# Altium project fillcap.PrjPcb
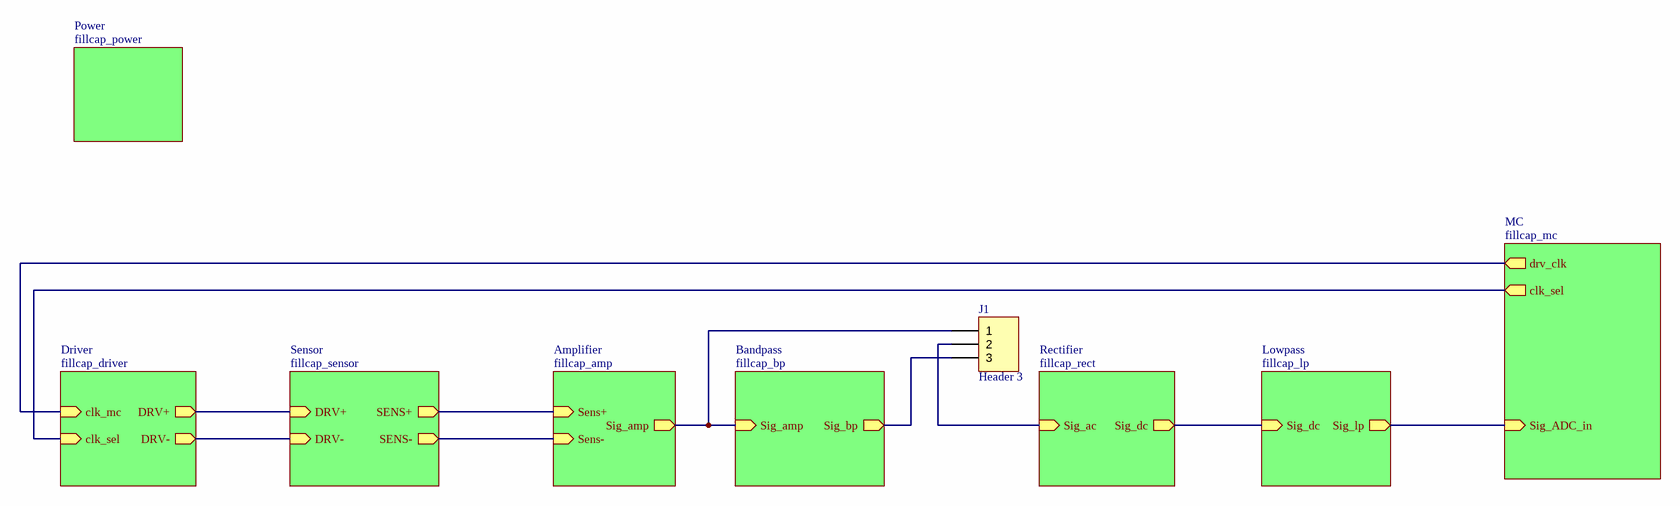
[diagram p0: fillcap_top.SchDoc]
9 sheets, 65 parts. Net scope: hierarchical (ports join the sheet entries above them; power ports are global).
Board file: fillcap.PcbDoc
Sheets:
  fillcap_top.SchDoc
    Driver = fillcap_driver.SchDoc
    Sensor = fillcap_sensor.SchDoc
    Amplifier = fillcap_amp.SchDoc
    Bandpass = fillcap_bp.SchDoc
    Rectifier = fillcap_rect.SchDoc
    Lowpass = fillcap_lp.SchDoc
    MC = fillcap_mc.SchDoc
    Power = fillcap_power.SchDoc

## Sheet fillcap_top.SchDoc: Top
size A3; DrawnBy: daniw / ninux; Organization: HSLU T&A; Address1: Abteilung Elektrotechnik; Address2: Technikumsstrasse 21; Address3: CH-6048 Horw; SheetNumber: 1; SheetTotal: 9; Projektname: fillcap

### Parts
J1  Header 3  [HDR1X3]

### Sub-sheets
Amplifier = fillcap_amp: Sens+ (in), Sens- (in), Sig_amp (out)
Bandpass = fillcap_bp: Sig_amp (in), Sig_bp (out)
Driver = fillcap_driver: DRV+ (out), DRV- (out), clk_mc (in), clk_sel (in)
Lowpass = fillcap_lp: Sig_dc (in), Sig_lp (out)
MC = fillcap_mc: Sig_ADC_in (in), drv_clk (out), clk_sel (out)
Power = fillcap_power: no entries
Rectifier = fillcap_rect: Sig_ac (in), Sig_dc (out)
Sensor = fillcap_sensor: DRV+ (in), DRV- (in), SENS+ (out), SENS- (out)

### Nets
NetC102#1_2: sheet Driver/DRV+, sheet Sensor/DRV+
NetC103#1_2: sheet Driver/DRV-, sheet Sensor/DRV-
NetC401_2: J1.1 ; sheet Amplifier/Sig_amp, sheet Bandpass/Sig_amp
NetC402_1: J1.3 ; sheet Bandpass/Sig_bp
NetC501_2: J1.2 ; sheet Rectifier/Sig_ac
NetC502_1: sheet Rectifier/Sig_dc, sheet Lowpass/Sig_dc
NetJ201_4: sheet Sensor/SENS+, sheet Amplifier/Sens+
NetJ202_4: sheet Sensor/SENS-, sheet Amplifier/Sens-
NetR604_2: sheet Lowpass/Sig_lp, sheet MC/Sig_ADC_in
NetU101_5: sheet Driver/clk_sel, sheet MC/clk_sel
NetU101_13: sheet Driver/clk_mc, sheet MC/drv_clk

### Notes on the sheet
- Project:
- Drawn by:
- Size:
- Sheet
- A3
- Rev.:
- of
- Date:
- File:

### Library data of the parts
J1 = Header 3: Header, 3-Pin; LatestRevisionDate: 17-Jul-2002; LatestRevisionNote: Re-released for DXP Platform.; Publisher: Altium Limited

## Sheet fillcap_driver.SchDoc: Driver
size A3; DrawnBy: daniw / ninux; Organization: HSLU T&A; Address1: Abteilung Elektrotechnik; Address2: Technikumsstrasse 21; Address3: CH-6048 Horw; SheetNumber: 2; SheetTotal: 9; Projektname: fillcap
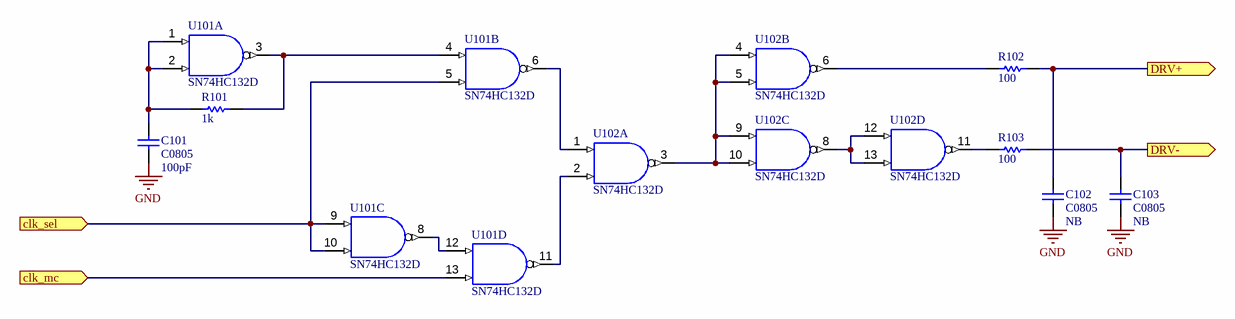
[diagram p1: fillcap_driver.SchDoc]

### Parts
(Parts that share a designator on the sheet are numbered #1, #2 ... from top to bottom, then left to right.)
C101  C0805  value 100pF  [0805]
C102#1  C0805  value NB  [0805]
C103#1  C0805  value NB  [0805]
R101  1k  [ERA-0805]
R102  100  [ERA-0805]
R103  100  [ERA-0805]
U101  SN74HC132D  [D014_N]  (parts A,B,C,D of 4)
U102  SN74HC132D  [D014_N]  (parts A,B,C,D of 4)

### Ports
clk_mc (in), clk_sel (in), DRV+ (out), DRV- (out)

### Nets
GND: C101.1 C102#1.1 C103#1.1 U101.7(GND) U102.7(GND)
VCC: U101.14(VCC) U102.14(VCC)
NetC101_2: C101.2 R101.1 U101.1(A) U101.2(B)
NetC102#1_2: C102#1.2 R102.2 ; port DRV+
NetC103#1_2: C103#1.2 R103.2 ; port DRV-
NetR101_2: R101.2 U101.3(Y) U101.4(A)
NetR102_1: R102.1 U102.6(Y)
NetR103_1: R103.1 U102.11(Y)
NetU101_5: U101.5(B) U101.9(A) U101.10(B) ; port clk_sel
NetU101_6: U101.6(Y) U102.1(A)
NetU101_8: U101.8(Y) U101.12(A)
NetU101_11: U101.11(Y) U102.2(B)
NetU101_13: U101.13(B) ; port clk_mc
NetU102_3: U102.3(Y) U102.4(A) U102.5(B) U102.9(A) U102.10(B)
NetU102_8: U102.8(Y) U102.12(A) U102.13(B)

### Notes on the sheet
- Project:
- Drawn by:
- Size:
- Sheet
- A3
- Rev.:
- of
- Date:
- File:

### Library data of the parts
C101 C102#1 C103#1 = C0805: Ceramic Chip Capacitor - Standard; Note: Footprint corresponds to dimensions for bulk cassette packaging. This case size has tightened tolerances.; Published: 17-Jul-2002; LatestRevisionDate: 19-Mar-2004; LatestRevisionNote: Silkscreen size reduced.; DatasheetDocument: Mar-2001; PackageDocument: Mar-2001; PackageReference: 0805; Publisher: Altium Limited; Code_JEITA: 0805; Code_IPC: 2012[0805]; ComponentLink1Description: Manufacturer Link; ComponentLink1URL: http://www.kemet.com/; ComponentLink2Description: Datasheet; ComponentLink2URL: http://www.kemet.com/kemet/web/homepage/kechome.nsf/vapubfilesname/F3102TA.pdf/$file/F3102TA.pdf
R101-R103 = ERAS: Metal Film Thermosensitive Chip Resistor, 0.56 Ohm to 10k Ohm Range, 5% Tolerance, 0805 Size, 0.1 W; Note: If flow soldering, adjust pad width of PCB Footprint to 0.7 - 0.8 times the width of the resistor.; Published: 17-Dec-2003; LatestRevisionDate: 19-Mar-2004; LatestRevisionNote: Silkscreen size reduced.; PackageDocument: Mar-2003; PackageReference: ERA-0805; Publisher: Altium Limited; Code_IPC: 2012 [0805]; ComponentLink1Description: Manufacturer Link; ComponentLink1URL: http://www.panasonic.com/industrial/components/resistive_products.htm; ComponentLink2Description: Datasheet; ComponentLink2URL: http://www.panasonic.com/industrial/components/pdf/AOF0000CE1.pdf
U101 U102 = SN74HC132D: Quadruple Positive-NAND Gate with Schmitt-Trigger Inputs; Published: 8-Jun-2000; LatestRevisionDate: 13-Apr-2006; LatestRevisionNote: IPC-7351 Footprint Added.; DatasheetVersion: May-1997; PackageVersion: Jan-1998; PackageReference: D014; Publisher: Altium Limited; PackageDescription: 14-Pin Small Outline Integrated Circuit 1.27 mm Pitch; Code_IPC: SOIC127P600-14; ComponentLink1Description: Manufacturer Link; ComponentLink1URL: http://www.ti.com/; ComponentLink2Description: Datasheet; ComponentLink2URL: http://www-s.ti.com/sc/ds/sn74hc132.pdf

## Sheet fillcap_sensor.SchDoc: Sensor
size A3; DrawnBy: daniw / ninux; Organization: HSLU T&A; Address1: Abteilung Elektrotechnik; Address2: Technikumsstrasse 21; Address3: CH-6048 Horw; SheetNumber: 3; SheetTotal: 9; Projektname: fillcap
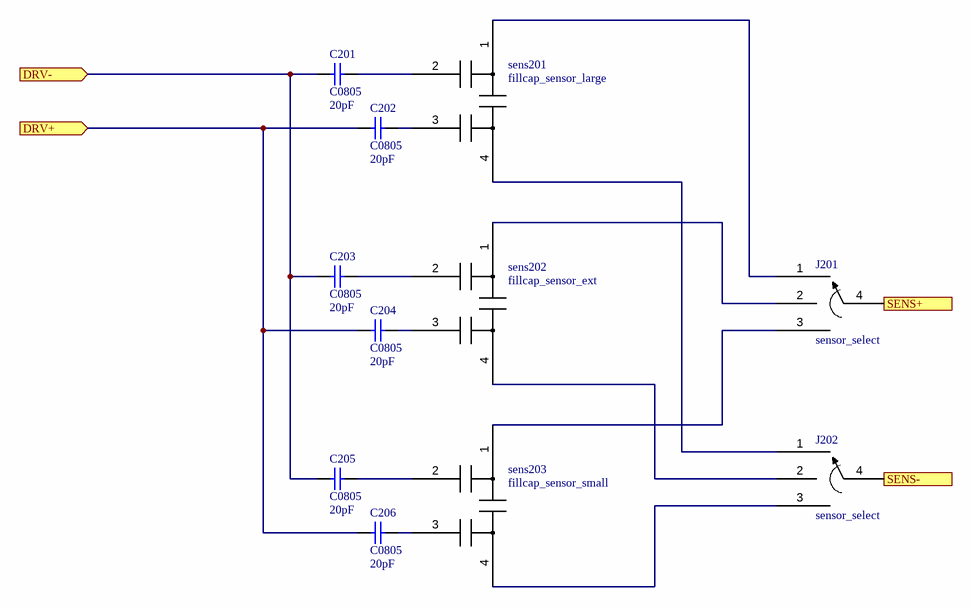
[diagram p2: fillcap_sensor.SchDoc]

### Parts
C201  C0805  value 20pF  [0805]
C202  C0805  value 20pF  [0805]
C203  C0805  value 20pF  [0805]
C204  C0805  value 20pF  [0805]
C205  C0805  value 20pF  [0805]
C206  C0805  value 20pF  [0805]
J201  sensor_select  [sens_select_jumper]
J202  sensor_select  [sens_select_jumper]
sens201  fillcap_sensor_large  [fillcap_sensor_large]
sens202  fillcap_sensor_ext  [fillcap_sensor_ext]
sens203  fillcap_sensor_small  [fillcap_sensor_small]

### Ports
DRV+ (in), DRV- (in), SENS+ (out), SENS- (out)

### Nets
NetC102#1_2: C202.2 C204.2 C206.2 ; port DRV+
NetC103#1_2: C201.2 C203.2 C205.2 ; port DRV-
NetC201_1: C201.1 sens201.2
NetC202_1: C202.1 sens201.3
NetC203_1: C203.1 sens202.2
NetC204_1: C204.1 sens202.3
NetC205_1: C205.1 sens203.2
NetC206_1: C206.1 sens203.3
NetJ201_1: J201.1 sens201.1
NetJ201_2: J201.2 sens202.1
NetJ201_3: J201.3 sens203.1
NetJ201_4: J201.4 ; port SENS+
NetJ202_1: J202.1 sens201.4
NetJ202_2: J202.2 sens202.4
NetJ202_3: J202.3 sens203.4
NetJ202_4: J202.4 ; port SENS-

### Notes on the sheet
- Project:
- Drawn by:
- Size:
- Sheet
- A3
- Rev.:
- of
- Date:
- File:

### Library data of the parts
C201-C206 = C0805: as C101 on sheet fillcap_driver; Published: 17-Jul-2002; LatestRevisionDate: 19-Mar-2004; LatestRevisionNote: Silkscreen size reduced.; DatasheetDocument: Mar-2001; PackageDocument: Mar-2001; PackageReference: 0805; Publisher: Altium Limited; Code_JEITA: 0805; Code_IPC: 2012[0805]; ComponentLink1Description: Manufacturer Link; ComponentLink1URL: http://www.kemet.com/; ComponentLink2Description: Datasheet; ComponentLink2URL: http://www.kemet.com/kemet/web/homepage/kechome.nsf/vapubfilesname/F3102TA.pdf/$file/F3102TA.pdf
sens201-sens203 = fillcap_sensor

## Sheet fillcap_amp.SchDoc: Amplifier
size A3; DrawnBy: daniw / ninux; Organization: HSLU T&A; Address1: Abteilung Elektrotechnik; Address2: Technikumsstrasse 21; Address3: CH-6048 Horw; SheetNumber: 4; SheetTotal: 9; Projektname: fillcap
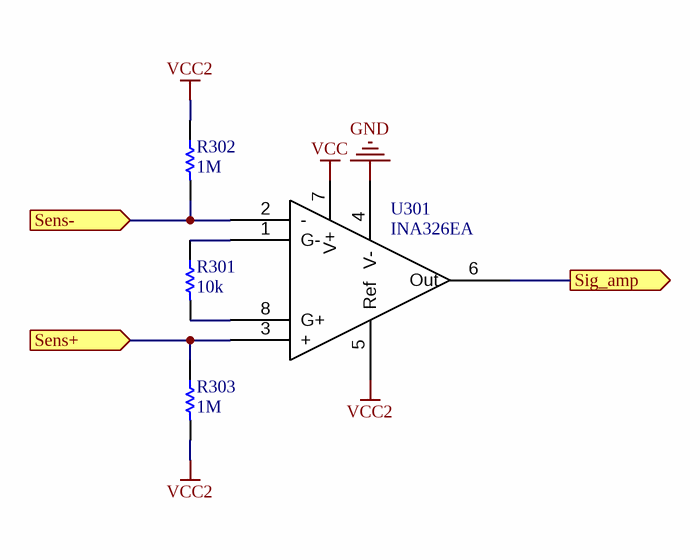
[diagram p3: fillcap_amp.SchDoc]

### Parts
R301  10k  [ERA-0805]
R302  1M  [ERA-0805]
R303  1M  [ERA-0805]
U301  INA326EA  [VSSOP8(0.65mm)]

### Ports
Sens+ (in), Sens- (in), Sig_amp (out)

### Nets
GND: U301.4(V-)
VCC: U301.7(V+)
VCC2: R302.1 R303.2 U301.5(Ref)
NetC401_2: U301.6(Out) ; port Sig_amp
NetJ201_4: R303.1 U301.3(+) ; port Sens+
NetJ202_4: R302.2 U301.2(-) ; port Sens-
NetR301_1: R301.1 U301.1(G-)
NetR301_2: R301.2 U301.8(G+)

### Notes on the sheet
- Project:
- Drawn by:
- Size:
- Sheet
- A3
- Rev.:
- of
- Date:
- File:

### Library data of the parts
R301-R303 = ERAS: as R101 on sheet fillcap_driver; Published: 17-Dec-2003; LatestRevisionDate: 19-Mar-2004; LatestRevisionNote: Silkscreen size reduced.; PackageDocument: Mar-2003; PackageReference: ERA-0805; Publisher: Altium Limited; Code_IPC: 2012 [0805]; ComponentLink1Description: Manufacturer Link; ComponentLink1URL: http://www.panasonic.com/industrial/components/resistive_products.htm; ComponentLink2Description: Datasheet; ComponentLink2URL: http://www.panasonic.com/industrial/components/pdf/AOF0000CE1.pdf

## Sheet fillcap_bp.SchDoc: Bandpass
size A3; DrawnBy: daniw / ninux; Organization: HSLU T&A; Address1: Abteilung Elektrotechnik; Address2: Technikumsstrasse 21; Address3: CH-6048 Horw; SheetNumber: 5; SheetTotal: 9; Projektname: fillcap
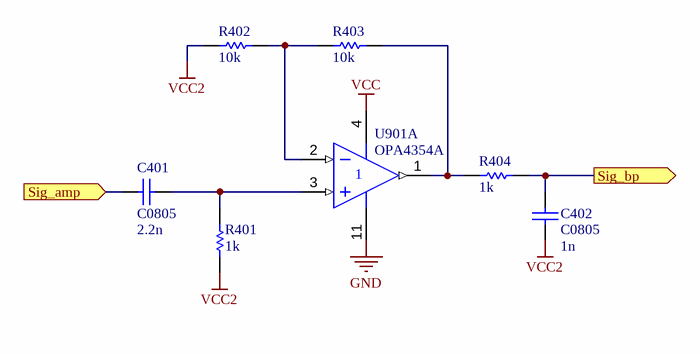
[diagram p4: fillcap_bp.SchDoc]

### Parts
C401  C0805  value 2.2n  [0805]
C402  C0805  value 1n  [0805]
R401  1k  [ERA-0805]
R402  10k  [ERA-0805]
R403  10k  [ERA-0805]
R404  1k  [ERA-0805]
U901  OPA4354A  [D014_N]  (part A of 4)

### Ports
Sig_amp (in), Sig_bp (out)

### Nets
GND: U901.11(V-)
VCC: U901.4(V+)
VCC2: C402.2 R401.2 R402.1
NetC401_1: C401.1 R401.1 U901.3(IN+)
NetC401_2: C401.2 ; port Sig_amp
NetC402_1: C402.1 R404.2 ; port Sig_bp
NetR402_2: R402.2 R403.1 U901.2(IN-)
NetR403_2: R403.2 R404.1 U901.1(OUT)

### Notes on the sheet
- Project:
- Drawn by:
- Size:
- Sheet
- A3
- Rev.:
- of
- Date:
- File:

### Library data of the parts
C401 C402 = C0805: as C101 on sheet fillcap_driver; Published: 17-Jul-2002; LatestRevisionDate: 19-Mar-2004; LatestRevisionNote: Silkscreen size reduced.; DatasheetDocument: Mar-2001; PackageDocument: Mar-2001; PackageReference: 0805; Publisher: Altium Limited; Code_JEITA: 0805; Code_IPC: 2012[0805]; ComponentLink1Description: Manufacturer Link; ComponentLink1URL: http://www.kemet.com/; ComponentLink2Description: Datasheet; ComponentLink2URL: http://www.kemet.com/kemet/web/homepage/kechome.nsf/vapubfilesname/F3102TA.pdf/$file/F3102TA.pdf
R401-R404 = ERAS: as R101 on sheet fillcap_driver; Published: 17-Dec-2003; LatestRevisionDate: 19-Mar-2004; LatestRevisionNote: Silkscreen size reduced.; PackageDocument: Mar-2003; PackageReference: ERA-0805; Publisher: Altium Limited; Code_IPC: 2012 [0805]; ComponentLink1Description: Manufacturer Link; ComponentLink1URL: http://www.panasonic.com/industrial/components/resistive_products.htm; ComponentLink2Description: Datasheet; ComponentLink2URL: http://www.panasonic.com/industrial/components/pdf/AOF0000CE1.pdf
U901 = LM324AD: Quadruple Operational Amplifier; Published: 15-Apr-2002; LatestRevisionDate: 13-Apr-2006; LatestRevisionNote: IPC-7351 Footprint Added.; DatasheetVersion: Jan-1989; PackageVersion: Jan-1998; PackageReference: D014; Publisher: Altium Limited; PackageDescription: 14-Pin Small Outline Integrated Circuit 1.27 mm Pitch; Code_IPC: SOIC127P600-14; ComponentLink1Description: Manufacturer Link; ComponentLink1URL: http://www.ti.com/; ComponentLink2Description: Datasheet; ComponentLink2URL: http://www-s.ti.com/sc/ds/lm324.pdf

## Sheet fillcap_rect.SchDoc: Rectifier
size A3; DrawnBy: daniw / ninux; Organization: HSLU T&A; Address1: Abteilung Elektrotechnik; Address2: Technikumsstrasse 21; Address3: CH-6048 Horw; SheetNumber: 6; SheetTotal: 9; Projektname: fillcap
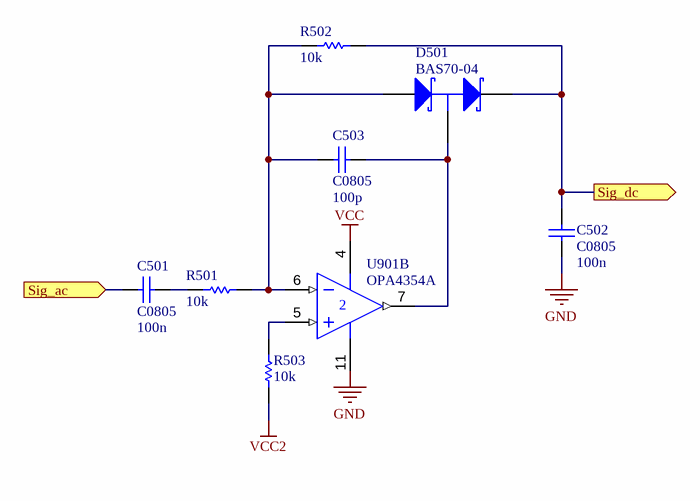
[diagram p5: fillcap_rect.SchDoc]

### Parts
C501  C0805  value 100n  [0805]
C502  C0805  value 100n  [0805]
C503  C0805  value 100p  [0805]
D501  BAS70-04  [SOT23_N]
R501  10k  [ERA-0805]
R502  10k  [ERA-0805]
R503  10k  [ERA-0805]
U901  OPA4354A  [D014_N]  (part B of 4)

### Ports
Sig_ac (in), Sig_dc (out)

### Nets
GND: C502.2 U901.11(V-)
VCC: U901.4(V+)
VCC2: R503.1
NetC501_1: C501.1 R501.1
NetC501_2: C501.2 ; port Sig_ac
NetC502_1: C502.1 D501.2(K) R502.2 ; port Sig_dc
NetC503_1: C503.1 D501.3(C) U901.7(OUT)
NetC503_2: C503.2 D501.1(A) R501.2 R502.1 U901.6(IN-)
NetR503_2: R503.2 U901.5(IN+)

### Notes on the sheet
- Project:
- Drawn by:
- Size:
- Sheet
- A3
- Rev.:
- of
- Date:
- File:

### Library data of the parts
C501-C503 = C0805: as C101 on sheet fillcap_driver; Published: 17-Jul-2002; LatestRevisionDate: 19-Mar-2004; LatestRevisionNote: Silkscreen size reduced.; DatasheetDocument: Mar-2001; PackageDocument: Mar-2001; PackageReference: 0805; Publisher: Altium Limited; Code_JEITA: 0805; Code_IPC: 2012[0805]; ComponentLink1Description: Manufacturer Link; ComponentLink1URL: http://www.kemet.com/; ComponentLink2Description: Datasheet; ComponentLink2URL: http://www.kemet.com/kemet/web/homepage/kechome.nsf/vapubfilesname/F3102TA.pdf/$file/F3102TA.pdf
D501 = BAS70-04: Schottky Barrier Double Diode; Published: 17-Sep-2003; LatestRevisionDate: 12-Dec-2006; LatestRevisionNote: IPC-7351 Footprint Added.; DatasheetVersion: 11-Oct-2001; PackageVersion: May-1999; PackageReference: SOT23; Publisher: Altium Limited; PackageDescription: 3-Pin SOT-23 Package 0.95 mm Pitch, 2.3 mm Lead Span; ComponentLink1Description: Manufacturer Link; ComponentLink1URL: http://www.semiconductors.philips.com/; ComponentLink2Description: Datasheet; ComponentLink2URL: http://www.semiconductors.philips.com/acrobat/datasheets/BAS70_SERIES_6.pdf
R501-R503 = ERAS: as R101 on sheet fillcap_driver; Published: 17-Dec-2003; LatestRevisionDate: 19-Mar-2004; LatestRevisionNote: Silkscreen size reduced.; PackageDocument: Mar-2003; PackageReference: ERA-0805; Publisher: Altium Limited; Code_IPC: 2012 [0805]; ComponentLink1Description: Manufacturer Link; ComponentLink1URL: http://www.panasonic.com/industrial/components/resistive_products.htm; ComponentLink2Description: Datasheet; ComponentLink2URL: http://www.panasonic.com/industrial/components/pdf/AOF0000CE1.pdf
U901 = LM324AD: Quadruple Operational Amplifier; Published: 15-Apr-2002; LatestRevisionDate: 13-Apr-2006; LatestRevisionNote: IPC-7351 Footprint Added.; DatasheetVersion: Jan-1989; PackageVersion: Jan-1998; PackageReference: D014; Publisher: Altium Limited; PackageDescription: 14-Pin Small Outline Integrated Circuit 1.27 mm Pitch; Code_IPC: SOIC127P600-14; ComponentLink1Description: Manufacturer Link; ComponentLink1URL: http://www.ti.com/; ComponentLink2Description: Datasheet; ComponentLink2URL: http://www-s.ti.com/sc/ds/lm324.pdf

## Sheet fillcap_lp.SchDoc: Lowpass
size A3; DrawnBy: daniw / ninux; Organization: HSLU T&A; Address1: Abteilung Elektrotechnik; Address2: Technikumsstrasse 21; Address3: CH-6048 Horw; SheetNumber: 7; SheetTotal: 9; Projektname: fillcap
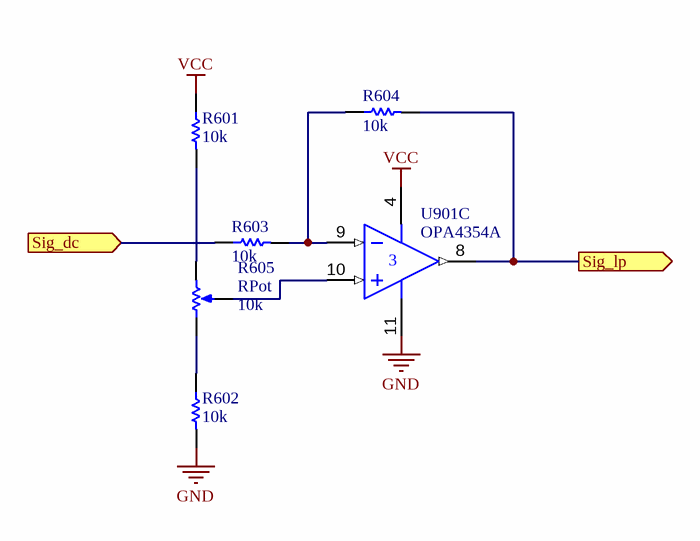
[diagram p6: fillcap_lp.SchDoc]

### Parts
R601  10k  [ERA-0805]
R602  10k  [ERA-0805]
R603  10k  [ERA-0805]
R604  10k  [ERA-0805]
R605  RPot  value 10k  [VR5]
U901  OPA4354A  [D014_N]  (part C of 4)

### Ports
Sig_dc (in), Sig_lp (out)

### Nets
GND: R602.2 U901.11(V-)
VCC: R601.1 U901.4(V+)
NetC502_1: R603.1 ; port Sig_dc
NetR601_2: R601.2 R605.2(BOT)
NetR602_1: R602.1 R605.1(TOP)
NetR603_2: R603.2 R604.1 U901.9(IN-)
NetR604_2: R604.2 U901.8(OUT) ; port Sig_lp
NetR605_3: R605.3(TAP) U901.10(IN+)

### Notes on the sheet
- Project:
- Drawn by:
- Size:
- Sheet
- A3
- Rev.:
- of
- Date:
- File:

### Library data of the parts
R601-R604 = ERAS: as R101 on sheet fillcap_driver; Published: 17-Dec-2003; LatestRevisionDate: 19-Mar-2004; LatestRevisionNote: Silkscreen size reduced.; PackageDocument: Mar-2003; PackageReference: ERA-0805; Publisher: Altium Limited; Code_IPC: 2012 [0805]; ComponentLink1Description: Manufacturer Link; ComponentLink1URL: http://www.panasonic.com/industrial/components/resistive_products.htm; ComponentLink2Description: Datasheet; ComponentLink2URL: http://www.panasonic.com/industrial/components/pdf/AOF0000CE1.pdf
R605 = RPot: Potentiometer; Sim Note: Enter the Resistance value and the set point into parameter fields.; Set Position: 0.5; Published: 8-Jun-2000; LatestRevisionDate: 17-Jul-2002; LatestRevisionNote: Re-released for DXP Platform.; PackageReference: VR5; Publisher: Altium Limited; PackageDescription: Variable Resistor, Thru-Hole; 3 Leads
U901 = LM324AD: Quadruple Operational Amplifier; Published: 15-Apr-2002; LatestRevisionDate: 13-Apr-2006; LatestRevisionNote: IPC-7351 Footprint Added.; DatasheetVersion: Jan-1989; PackageVersion: Jan-1998; PackageReference: D014; Publisher: Altium Limited; PackageDescription: 14-Pin Small Outline Integrated Circuit 1.27 mm Pitch; Code_IPC: SOIC127P600-14; ComponentLink1Description: Manufacturer Link; ComponentLink1URL: http://www.ti.com/; ComponentLink2Description: Datasheet; ComponentLink2URL: http://www-s.ti.com/sc/ds/lm324.pdf

## Sheet fillcap_mc.SchDoc: Microcontroller
size A3; DrawnBy: daniw / ninux; Organization: HSLU T&A; Address1: Abteilung Elektrotechnik; Address2: Technikumsstrasse 21; Address3: CH-6048 Horw; SheetNumber: 8; SheetTotal: 9; Projektname: fillcap
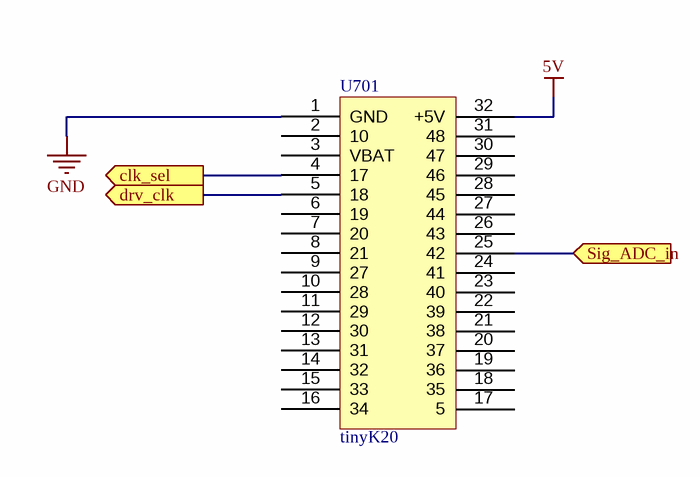
[diagram p7: fillcap_mc.SchDoc]

### Parts
U701  tinyK20  [tinyK20_full_mount]

### Ports
clk_sel (out), drv_clk (out), Sig_ADC_in (in)

### Nets
5V: U701.32(+5V)
GND: U701.1(GND)
NetR604_2: U701.25(42) ; port Sig_ADC_in
NetU101_5: U701.4(17) ; port clk_sel
NetU101_13: U701.5(18) ; port drv_clk

Not connected (* = marked no-connect by the designer): U701 2(10) 3(VBAT) 6(19) 7(20) 8(21) 9(27) 10(28) 11(29) 12(30) 13(31) 14(32) 15(33) 16(34) 17(5) 18(35) 19(36) 20(37) 21(38) 22(39) 23(40) 24(41) 26(43) 27(44) 28(45) 29(46) 30(47) 31(48)

### Notes on the sheet
- Project:
- Drawn by:
- Size:
- Sheet
- A3
- Rev.:
- of
- Date:
- File:

## Sheet fillcap_power.SchDoc: Power
size A3; DrawnBy: daniw / ninux; Organization: HSLU T&A; Address1: Abteilung Elektrotechnik; Address2: Technikumsstrasse 21; Address3: CH-6048 Horw; SheetNumber: 9; SheetTotal: 9; Projektname: fillcap
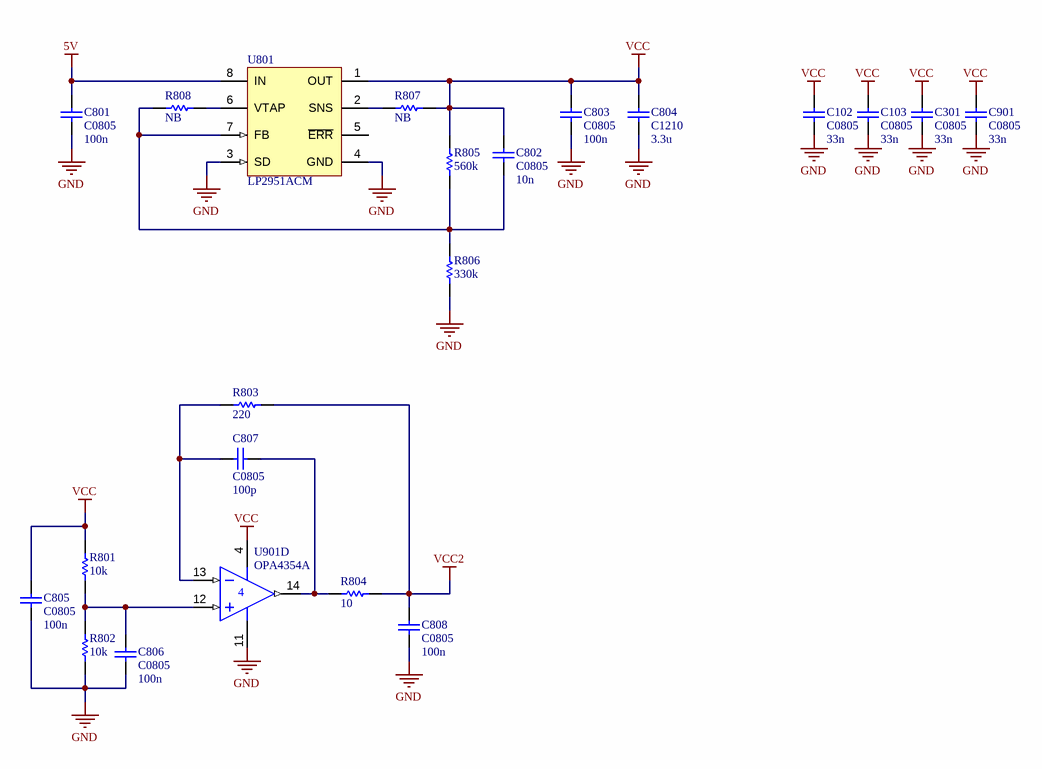
[diagram p8: fillcap_power.SchDoc]

### Parts
(Parts that share a designator on the sheet are numbered #1, #2 ... from top to bottom, then left to right.)
C102#2  C0805  value 33n  [0805]
C103#2  C0805  value 33n  [0805]
C301  C0805  value 33n  [0805]
C801  C0805  value 100n  [0805]
C802  C0805  value 10n  [0805]
C803  C0805  value 100n  [0805]
C804  C1210  value 3.3u  [1210]
C805  C0805  value 100n  [0805]
C806  C0805  value 100n  [0805]
C807  C0805  value 100p  [0805]
C808  C0805  value 100n  [0805]
C901  C0805  value 33n  [0805]
R801  10k  [ERA-0805]
R802  10k  [ERA-0805]
R803  220  [ERA-0805]
R804  10  [ERA-0805]
R805  560k  [ERA-0805]
R806  330k  [ERA-0805]
R807  NB  [ERA-0805]
R808  NB  [ERA-0805]
U801  LP2951ACM  [M08A_N]
U901  OPA4354A  [D014_N]  (part D of 4)

### Nets
5V: C801.2 U801.8(IN)
GND: C102#2.1 C103#2.1 C301.1 C801.1 C803.1 C804.1 C805.1 C806.1 C808.1 C901.1 R802.2 R806.2 U801.3(SD) U801.4(GND) U901.11(V-)
VCC: C102#2.2 C103#2.2 C301.2 C802.2 C803.2 C804.2 C805.2 C901.2 R801.1 R805.1 R807.2 U801.1(OUT) U901.4(V+)
VCC2: C808.2 R803.2 R804.2
NetC802_1: C802.1 R805.2 R806.1 R808.1 U801.7(FB)
NetC806_2: C806.2 R801.2 R802.1 U901.12(IN+)
NetC807_1: C807.1 R803.1 U901.13(IN-)
NetC807_2: C807.2 R804.1 U901.14(OUT)
NetR807_1: R807.1 U801.2(SNS)
NetR808_2: R808.2 U801.6(VTAP)

Not connected (* = marked no-connect by the designer): U801 5(~{ERR})

### Notes on the sheet
- Project:
- Drawn by:
- Size:
- Sheet
- A3
- Rev.:
- of
- Date:
- File:

### Library data of the parts
C102#2 C103#2 C301 C801-C803 C805-C808 C901 = C0805: as C101 on sheet fillcap_driver; Published: 17-Jul-2002; LatestRevisionDate: 19-Mar-2004; LatestRevisionNote: Silkscreen size reduced.; DatasheetDocument: Mar-2001; PackageDocument: Mar-2001; PackageReference: 0805; Publisher: Altium Limited; Code_JEITA: 0805; Code_IPC: 2012[0805]; ComponentLink1Description: Manufacturer Link; ComponentLink1URL: http://www.kemet.com/; ComponentLink2Description: Datasheet; ComponentLink2URL: http://www.kemet.com/kemet/web/homepage/kechome.nsf/vapubfilesname/F3102TA.pdf/$file/F3102TA.pdf
C804 = C1210: Ceramic Chip Capacitor - Standard; Published: 17-Jul-2002; LatestRevisionDate: 19-Mar-2004; LatestRevisionNote: Silkscreen size reduced.; DatasheetDocument: Mar-2001; PackageDocument: Mar-2001; PackageReference: 1210; Publisher: Altium Limited; Code_JEITA: 1210; Code_IPC: 3225 [1210]; ComponentLink1Description: Manufacturer Link; ComponentLink1URL: http://www.kemet.com/; ComponentLink2Description: Datasheet; ComponentLink2URL: http://www.kemet.com/kemet/web/homepage/kechome.nsf/vapubfilesname/F3102TA.pdf/$file/F3102TA.pdf
R801-R808 = ERAS: as R101 on sheet fillcap_driver; Published: 17-Dec-2003; LatestRevisionDate: 19-Mar-2004; LatestRevisionNote: Silkscreen size reduced.; PackageDocument: Mar-2003; PackageReference: ERA-0805; Publisher: Altium Limited; Code_IPC: 2012 [0805]; ComponentLink1Description: Manufacturer Link; ComponentLink1URL: http://www.panasonic.com/industrial/components/resistive_products.htm; ComponentLink2Description: Datasheet; ComponentLink2URL: http://www.panasonic.com/industrial/components/pdf/AOF0000CE1.pdf
U801 = LP2951ACM: Series of Adjustable Micropower Voltage Regulators, 8-pin Narrow SOIC; Manufacturer: National Semiconductor; PackageTopMarking: NSZXTT*2951*ACMDD; PowerWise: N; CompType: LDO IC; Published: 4-Dec-2008; LatestRevisionDate: 07-Sep-2009; LatestRevisionNote: Bar removed from pin 3; DatasheetVersion: Jun-2009; PackageVersion: revM, May-2009; PackageReference: M08A; Publisher: Altium Limited; PackageDescription: SOIC Narrow, 4.9 x 3.9 x 1.45mm, 8 Lead, 1.27mm Pitch; Supplier 1: Farnell; Supplier Part Number 1: 9493425; PartNumber: LP2951ACM; RoHS: N; PinCount: 8; Code_JEDEC: MS-012-AA; Code_IPC: SOIC127P600-8; ComponentLink1Description: LP2951 Datasheet; ComponentLink1URL: http://www.national.com/ds/LP/LP2951.pdf; ComponentLink2Description: LP2951 Web Page; ComponentLink2URL: http://www.national.com/pf/LP/LP2951.html; ComponentLink3Description: M08A Package Page; ComponentLink3URL: http://www.national.com/packaging/folders/m08a.html
U901 = LM324AD: Quadruple Operational Amplifier; Published: 15-Apr-2002; LatestRevisionDate: 13-Apr-2006; LatestRevisionNote: IPC-7351 Footprint Added.; DatasheetVersion: Jan-1989; PackageVersion: Jan-1998; PackageReference: D014; Publisher: Altium Limited; PackageDescription: 14-Pin Small Outline Integrated Circuit 1.27 mm Pitch; Code_IPC: SOIC127P600-14; ComponentLink1Description: Manufacturer Link; ComponentLink1URL: http://www.ti.com/; ComponentLink2Description: Datasheet; ComponentLink2URL: http://www-s.ti.com/sc/ds/lm324.pdf

## Nets that join several sheets
5V: fillcap_mc (U701.32), fillcap_power (C801.2 U801.8)
GND: fillcap_driver (5 pins), fillcap_amp (U301.4), fillcap_bp (U901.11), fillcap_rect (C502.2 U901.11), fillcap_lp (R602.2 U901.11), fillcap_mc (U701.1), fillcap_power (15 pins)
VCC: fillcap_driver (U101.14 U102.14), fillcap_amp (U301.7), fillcap_bp (U901.4), fillcap_rect (U901.4), fillcap_lp (R601.1 U901.4), fillcap_power (13 pins)
VCC2: fillcap_amp (R302.1 R303.2 U301.5), fillcap_bp (C402.2 R401.2 R402.1), fillcap_rect (R503.1), fillcap_power (C808.2 R803.2 R804.2)
NetC102#1_2: fillcap_driver (C102#1.2 R102.2), fillcap_sensor (C202.2 C204.2 C206.2)
NetC103#1_2: fillcap_driver (C103#1.2 R103.2), fillcap_sensor (C201.2 C203.2 C205.2)
NetC401_2: fillcap_top (J1.1), fillcap_amp (U301.6), fillcap_bp (C401.2)
NetC402_1: fillcap_top (J1.3), fillcap_bp (C402.1 R404.2)
NetC501_2: fillcap_top (J1.2), fillcap_rect (C501.2)
NetC502_1: fillcap_rect (C502.1 D501.2 R502.2), fillcap_lp (R603.1)
NetJ201_4: fillcap_sensor (J201.4), fillcap_amp (R303.1 U301.3)
NetJ202_4: fillcap_sensor (J202.4), fillcap_amp (R302.2 U301.2)
NetR604_2: fillcap_lp (R604.2 U901.8), fillcap_mc (U701.25)
NetU101_5: fillcap_driver (U101.5 U101.9 U101.10), fillcap_mc (U701.4)
NetU101_13: fillcap_driver (U101.13), fillcap_mc (U701.5)